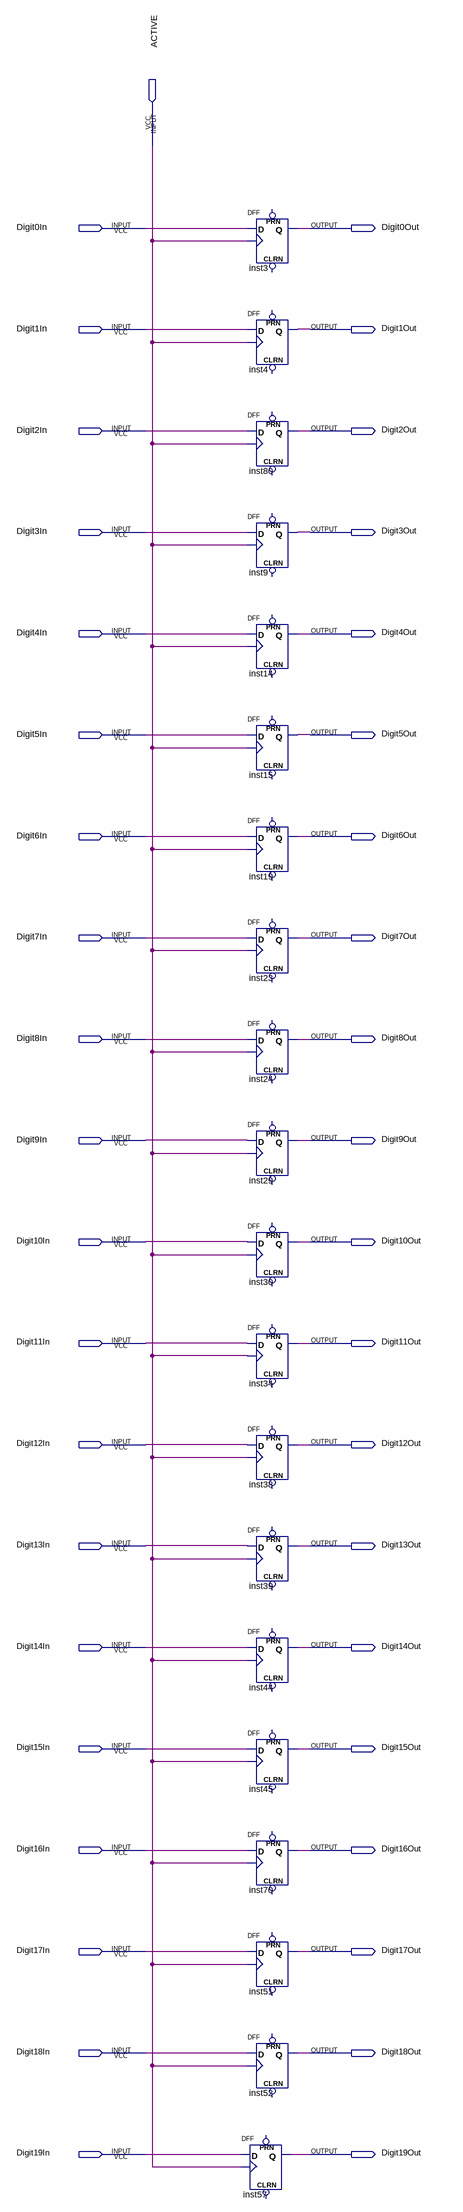
[diagram p0: schematic sheet]
// Quartus schematic Storage20bit.bdf as structural Verilog: 20 symbols, 41 pins
module Storage20bit (
  input  ACTIVE,
  input  Digit0In,
  input  Digit1In,
  input  Digit2In,
  input  Digit3In,
  input  Digit4In,
  input  Digit5In,
  input  Digit6In,
  input  Digit7In,
  input  Digit8In,
  input  Digit9In,
  input  Digit10In,
  input  Digit11In,
  input  Digit12In,
  input  Digit13In,
  input  Digit14In,
  input  Digit15In,
  input  Digit16In,
  input  Digit17In,
  input  Digit18In,
  input  Digit19In,
  output Digit0Out,
  output Digit1Out,
  output Digit2Out,
  output Digit3Out,
  output Digit4Out,
  output Digit5Out,
  output Digit6Out,
  output Digit7Out,
  output Digit8Out,
  output Digit9Out,
  output Digit10Out,
  output Digit11Out,
  output Digit12Out,
  output Digit13Out,
  output Digit14Out,
  output Digit15Out,
  output Digit16Out,
  output Digit17Out,
  output Digit18Out,
  output Digit19Out
);

  DFF inst3 (.CLK(ACTIVE), .D(Digit0In), .Q(Digit0Out));  // open: CLRN, PRN
  DFF inst4 (.CLK(ACTIVE), .D(Digit1In), .Q(Digit1Out));  // open: CLRN, PRN
  DFF inst80 (.CLK(ACTIVE), .D(Digit2In), .Q(Digit2Out));  // open: CLRN, PRN
  DFF inst9 (.CLK(ACTIVE), .D(Digit3In), .Q(Digit3Out));  // open: CLRN, PRN
  DFF inst14 (.CLK(ACTIVE), .D(Digit4In), .Q(Digit4Out));  // open: CLRN, PRN
  DFF inst15 (.CLK(ACTIVE), .D(Digit5In), .Q(Digit5Out));  // open: CLRN, PRN
  DFF inst19 (.CLK(ACTIVE), .D(Digit6In), .Q(Digit6Out));  // open: CLRN, PRN
  DFF inst23 (.CLK(ACTIVE), .D(Digit7In), .Q(Digit7Out));  // open: CLRN, PRN
  DFF inst24 (.CLK(ACTIVE), .D(Digit8In), .Q(Digit8Out));  // open: CLRN, PRN
  DFF inst29 (.CLK(ACTIVE), .D(Digit9In), .Q(Digit9Out));  // open: CLRN, PRN
  DFF inst30 (.CLK(ACTIVE), .D(Digit10In), .Q(Digit10Out));  // open: CLRN, PRN
  DFF inst34 (.CLK(ACTIVE), .D(Digit11In), .Q(Digit11Out));  // open: CLRN, PRN
  DFF inst38 (.CLK(ACTIVE), .D(Digit12In), .Q(Digit12Out));  // open: CLRN, PRN
  DFF inst39 (.CLK(ACTIVE), .D(Digit13In), .Q(Digit13Out));  // open: CLRN, PRN
  DFF inst44 (.CLK(ACTIVE), .D(Digit14In), .Q(Digit14Out));  // open: CLRN, PRN
  DFF inst45 (.CLK(ACTIVE), .D(Digit15In), .Q(Digit15Out));  // open: CLRN, PRN
  DFF inst70 (.CLK(ACTIVE), .D(Digit16In), .Q(Digit16Out));  // open: CLRN, PRN
  DFF inst51 (.CLK(ACTIVE), .D(Digit17In), .Q(Digit17Out));  // open: CLRN, PRN
  DFF inst52 (.CLK(ACTIVE), .D(Digit18In), .Q(Digit18Out));  // open: CLRN, PRN
  DFF inst57 (.CLK(ACTIVE), .D(Digit19In), .Q(Digit19Out));  // open: CLRN, PRN
endmodule
